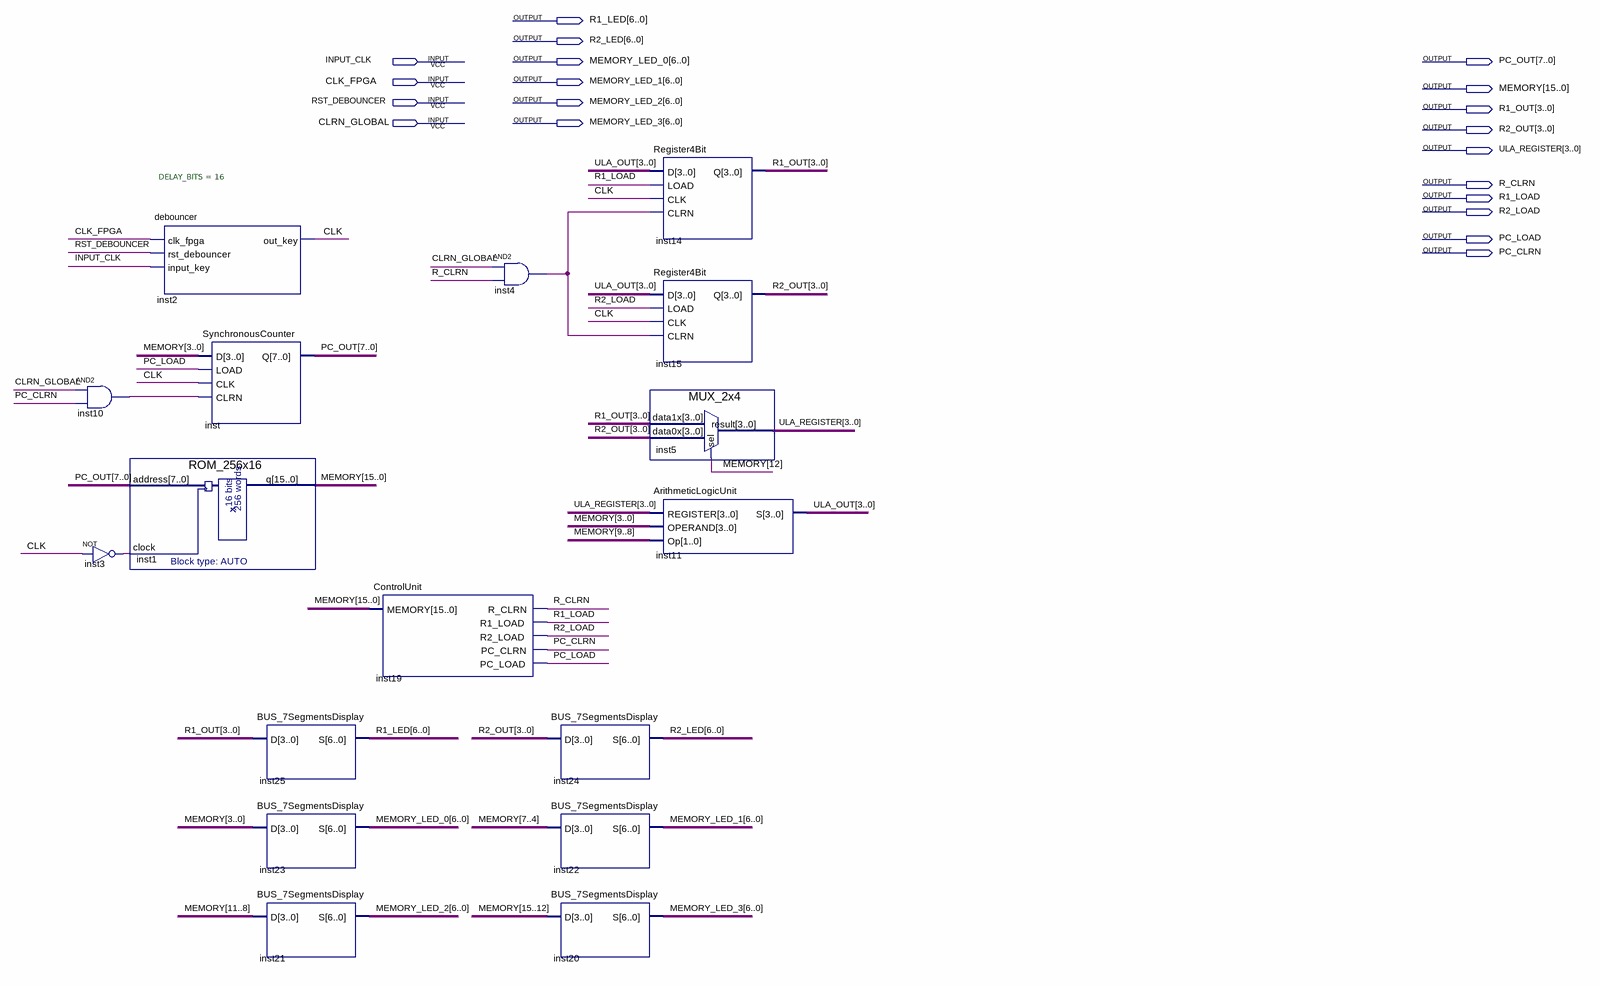
[diagram p0: schematic sheet]
// Quartus schematic MiniCPU.bdf as structural Verilog: 17 symbols, 20 pins
module MiniCPU (
  input  INPUT_CLK,
  input  CLK_FPGA,
  input  RST_DEBOUNCER,
  input  CLRN_GLOBAL,
  output [6:0] R1_LED,
  output [6:0] R2_LED,
  output [6:0] MEMORY_LED_0,
  output [7:0] PC_OUT,
  output [6:0] MEMORY_LED_1,
  output [15:0] MEMORY,
  output [6:0] MEMORY_LED_2,
  output [3:0] R1_OUT,
  output [6:0] MEMORY_LED_3,
  output [3:0] R2_OUT,
  output [3:0] ULA_REGISTER,
  output R_CLRN,
  output R1_LOAD,
  output R2_LOAD,
  output PC_LOAD,
  output PC_CLRN
);

  wire CLK, inst3_out, inst4_out, inst10_out;
  wire [3:0] ULA_OUT;

  and inst10 (inst10_out, CLRN_GLOBAL, PC_CLRN);
  not inst3 (inst3_out, CLK);
  ROM_256x16 inst1 (.address(PC_OUT), .clock(inst3_out), .q(MEMORY));
  debouncer #(.DELAY_BITS(16)) inst2 (
    .clk_fpga(CLK_FPGA), .rst_debouncer(RST_DEBOUNCER), .input_key(INPUT_CLK), .out_key(CLK));
  SynchronousCounter inst (.D(MEMORY[3:0]), .LOAD(PC_LOAD), .CLK(CLK), .CLRN(inst10_out), .Q(PC_OUT));
  BUS_7SegmentsDisplay inst25 (.D(R1_OUT), .S(R1_LED));
  BUS_7SegmentsDisplay inst23 (.D(MEMORY[3:0]), .S(MEMORY_LED_0));
  BUS_7SegmentsDisplay inst21 (.D(MEMORY[11:8]), .S(MEMORY_LED_2));
  ControlUnit inst19 (
    .MEMORY(MEMORY), .R_CLRN(R_CLRN), .R1_LOAD(R1_LOAD), .R2_LOAD(R2_LOAD), .PC_CLRN(PC_CLRN),
    .PC_LOAD(PC_LOAD));
  and inst4 (inst4_out, CLRN_GLOBAL, R_CLRN);
  BUS_7SegmentsDisplay inst24 (.D(R2_OUT), .S(R2_LED));
  BUS_7SegmentsDisplay inst22 (.D(MEMORY[7:4]), .S(MEMORY_LED_1));
  BUS_7SegmentsDisplay inst20 (.D(MEMORY[15:12]), .S(MEMORY_LED_3));
  Register4Bit inst14 (.D(ULA_OUT), .LOAD(R1_LOAD), .CLK(CLK), .CLRN(inst4_out), .Q(R1_OUT));
  Register4Bit inst15 (.D(ULA_OUT), .LOAD(R2_LOAD), .CLK(CLK), .CLRN(inst4_out), .Q(R2_OUT));
  MUX_2x4 inst5 (.data1x(R1_OUT), .data0x(R2_OUT), .sel(MEMORY[12]), .result(ULA_REGISTER));
  ArithmeticLogicUnit inst11 (.REGISTER(ULA_REGISTER), .OPERAND(MEMORY[3:0]), .Op(MEMORY[9:8]), .S(ULA_OUT));
endmodule
